# Altium schematic sheet [03] - NDP, LRA and BLE.SchDoc
size A3; DrawnBy: JW; DocumentNumber: 3; SheetNumber: 3; SheetTotal: 3
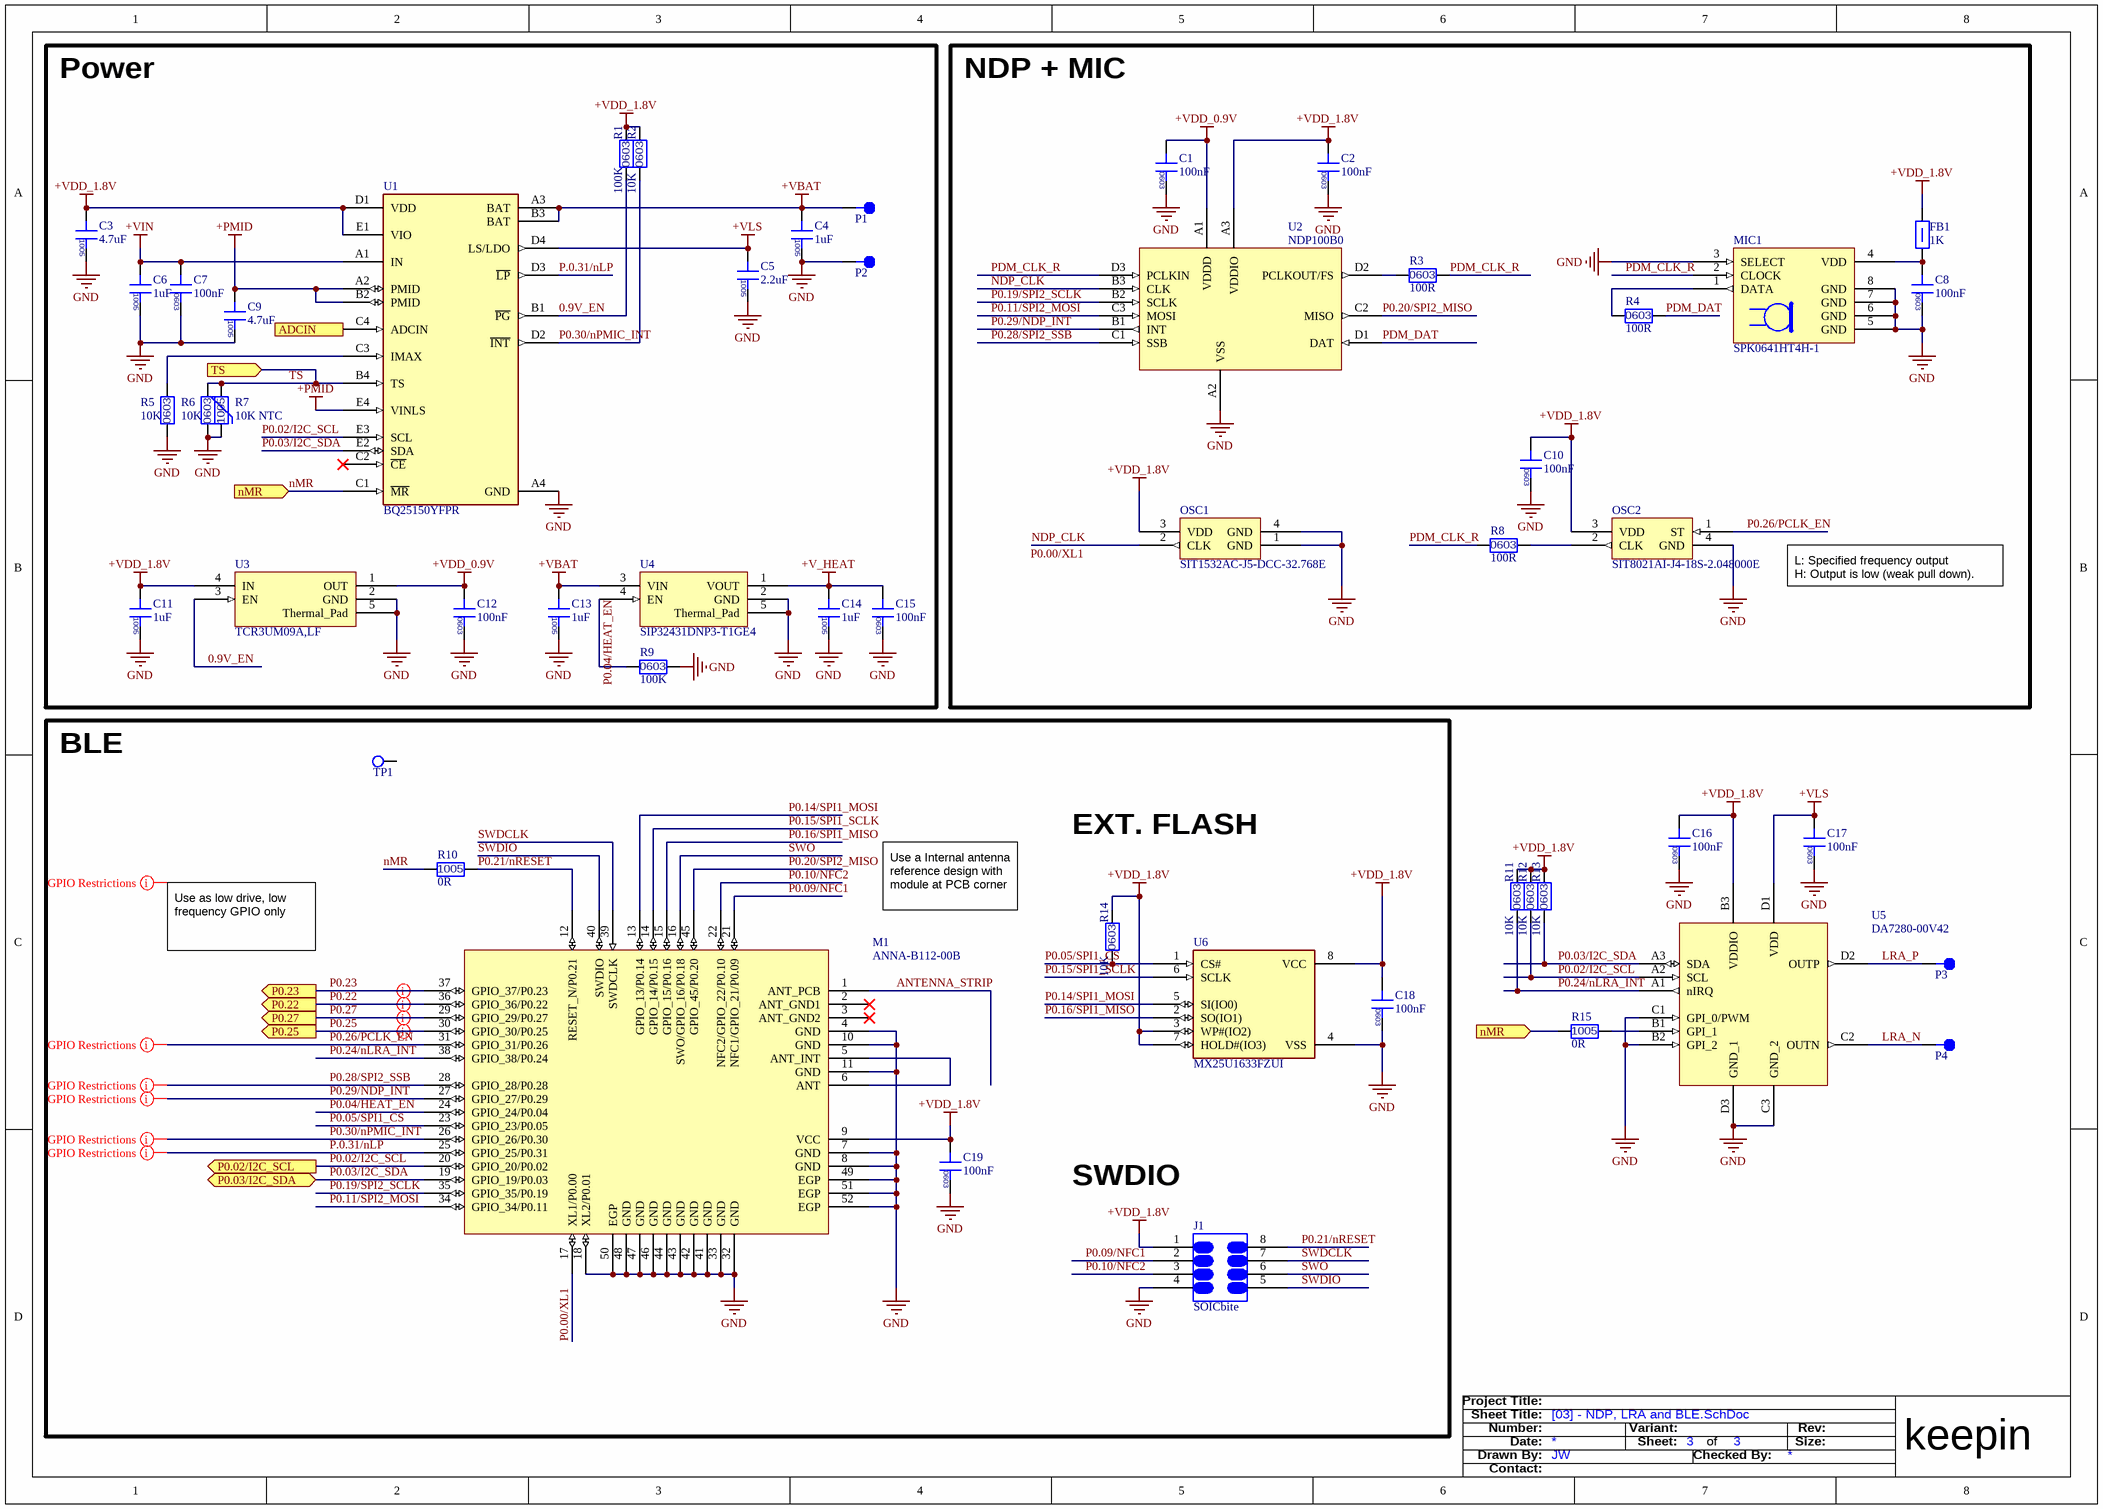
[diagram p0: [03] - NDP, LRA and BLE.SchDoc]

## Parts
C1  100nF  [CAPC0603X03N]
C2  100nF  [CAPC0603X03N]
C3  4.7uF  [CAPC1005X06N]
C4  1uF  [CAPC1005X06N]
C5  2.2uF  [CAPC1005X06N]
C6  1uF  [CAPC1005X06N]
C7  100nF  [CAPC0603X03N]
C8  100nF  [CAPC0603X03N]
C9  4.7uF  [CAPC1005X06N]
C10  100nF  [CAPC0603X03N]
C11  1uF  [CAPC1005X06N]
C12  100nF  [CAPC0603X03N]
C13  1uF  [CAPC1005X06N]
C14  1uF  [CAPC1005X06N]
C15  100nF  [CAPC0603X03N]
C16  100nF  [CAPC0603X03N]
C17  100nF  [CAPC0603X03N]
C18  100nF  [CAPC0603X03N]
C19  100nF  [CAPC0603X03N]
FB1  1K  [INDC1005X05N]
J1  SOICbite  [SOICBITE]  (no BOM)
M1  ANNA-B112-00B  [ANNA-B112]
MIC1  SPK0641HT4H-1  [MIC_SPK0838HT4H-1]
OSC1  SIT1532AC-J5-DCC-32.768E  [SIT1532]
OSC2  SIT8021AI-J4-18S-2.048000E  [SIT1532]
P1  1x1_Octagonal_1.27  [1x1_OCTAGONAL_1.27]  (value not drawn)  (no BOM)
P2  1x1_Octagonal_1.27  [1x1_OCTAGONAL_1.27]  (value not drawn)  (no BOM)
P3  1x1_Octagonal_1.27  [1x1_OCTAGONAL_1.27]  (value not drawn)  (no BOM)
P4  1x1_Octagonal_1.27  [1x1_OCTAGONAL_1.27]  (value not drawn)  (no BOM)
R1  100K  [RESC0603X02N]
R2  10K  [RESC0603X02N]
R3  100R  [RESC0603X02N]
R4  100R  [RESC0603X02N]
R5  10K  [RESC0603X02N]
R6  10K  [RESC0603X02N]
R7  10K NTC  [NTC1005X05N]
R8  100R  [RESC0603X02N]
R9  100K  [RESC0603X02N]
R10  0R  [RESC1005X04N]
R11  10K  [RESC0603X02N]
R12  10K  [RESC0603X02N]
R13  10K  [RESC0603X02N]
R14  10K  [RESC0603X02N]
R15  0R  [RESC1005X04N]
TP1  TESTPOINT  [TESTPOINT_1mm]  (value not drawn)  (no BOM)
U1  BQ25150YFPR  [YFP0020ACAC]
U2  NDP100B0  [NDP100B0_BGA12C40P3X4_139X176X55]
U3  TCR3UM09A,LF  [DQN-4]
U4  SIP32431DNP3-T1GE4  [SON50P160X60_HS-5N]
U5  DA7280-00V42  [BGA12C40P3X4_135X175X57]
U6  MX25U1633FZUI  [USON8_3X2]

## Blocks framed on the sheet
Power: C3-C7 C9 C11-C15 P1 P2 R1 R2 R5-R7 R9 U1 U3 U4
NDP + MIC: C1 C2 C8 C10 FB1 MIC1 OSC1 OSC2 R3 R4 R8 U2

## Ports
ADCIN (in), nMR (in), P0.02/I2C_SCL (out), P0.03/I2C_SDA (bidir), P0.22 (out), P0.23 (out), P0.25 (out), P0.27 (out), TS (in)

## Nets
+PMID: C9.2 U1.A2(PMID) U1.B2(PMID) U1.E4(VINLS)
+V_HEAT: C14.2 C15.2 U4.1(VOUT)
+VBAT: C4.2 C13.2 P1.1 U1.A3(BAT) U1.B3(BAT) U4.3(VIN)
+VDD_0.9V: C1.2 C12.2 U2.A1(VDDD) U3.1(OUT)
+VDD_1.8V: C2.2 C3.2 C10.2 C11.2 C16.2 C18.2 C19.2 FB1.1 J1.1 M1.9(VCC) OSC1.3(VDD) OSC2.3(VDD) R1.2 R2.2 R11.2 R12.2 R13.2 R14.2 U1.D1(VDD) U1.E1(VIO) U2.A3(VDDIO) U3.4(IN) U5.B3(VDDIO) U6.3(WP#(IO2)) U6.7(HOLD#(IO3)) U6.8(VCC)
+VIN: C6.2 C7.2 U1.A1(IN)
+VLS: C5.2 C17.2 U1.D4(LS/LDO) U5.D1(VDD)
GND: C1.1 C2.1 C3.1 C4.1 C5.1 C6.1 C7.1 C8.1 C9.1 C10.1 C11.1 C12.1 C13.1 C14.1 C15.1 C16.1 C17.1 C18.1 C19.1 J1.4 M1.4(GND) M1.7(GND) M1.8(GND) M1.10(GND) M1.11(GND) M1.18(XL2/P0.01) M1.32(GND) M1.33(GND) M1.41(GND) M1.42(GND) M1.43(GND) M1.44(GND) M1.46(GND) M1.47(GND) M1.48(GND) M1.49(EGP) M1.50(EGP) M1.51(EGP) M1.52(EGP) MIC1.3(SELECT) MIC1.5(GND) MIC1.6(GND) MIC1.7(GND) MIC1.8(GND) OSC1.1(GND) OSC1.4(GND) OSC2.4(GND) P2.1 R5.1 R6.1 R7.1 R9.2 U1.A4(GND) U2.A2(VSS) U3.2(GND) U3.5(Thermal_Pad) U4.2(GND) U4.5(Thermal_Pad) U5.B2(GPI_2) U5.C1(GPI_0/PWM) U5.C3(GND_2) U5.D3(GND_1) U6.4(VSS)
0.9V_EN: R1.1 U1.B1(~{PG}) U3.3(EN)
ADCIN: U1.C4(ADCIN) ; port ADCIN
ANTENNA_STRIP: M1.1(ANT_PCB)
LRA_N: P4.1 U5.C2(OUTN)
LRA_P: P3.1 U5.D2(OUTP)
NDP_CLK: M1.17(XL1/P0.00) OSC1.2(CLK) U2.B3(CLK)  [also labelled P0.00/XL1]
nMR: R10.1 R15.1 U1.C1(~{MR}) ; port nMR
P0.02/I2C_SCL: M1.20(GPIO_20/P0.02) R12.1 U1.E3(SCL) U5.A2(SCL) ; port P0.02/I2C_SCL
P0.03/I2C_SDA: M1.19(GPIO_19/P0.03) R13.1 U1.E2(SDA) U5.A3(SDA) ; port P0.03/I2C_SDA
P0.04/HEAT_EN: M1.24(GPIO_24/P0.04) R9.1 U4.4(EN)
P0.05/SPI1_CS: M1.23(GPIO_23/P0.05) R14.1 U6.1(CS#)
P0.09/NFC1: J1.2 M1.21(NFC1/GPIO_21/P0.09)
P0.10/NFC2: J1.3 M1.22(NFC2/GPIO_22/P0.10)
P0.11/SPI2_MOSI: M1.34(GPIO_34/P0.11) U2.C3(MOSI)
P0.14/SPI1_MOSI: M1.13(GPIO_13/P0.14) U6.5(SI(IO0))
P0.15/SPI1_SCLK: M1.14(GPIO_14/P0.15) U6.6(SCLK)
P0.16/SPI1_MISO: M1.15(GPIO_15/P0.16) U6.2(SO(IO1))
P0.19/SPI2_SCLK: M1.35(GPIO_35/P0.19) U2.B2(SCLK)
P0.20/SPI2_MISO: M1.45(GPIO_45/P0.20) U2.C2(MISO)
P0.21/nRESET: J1.8 M1.12(RESET_N/P0.21) R10.2
P0.22: M1.36(GPIO_36/P0.22) ; port P0.22
P0.23: M1.37(GPIO_37/P0.23) ; port P0.23
P0.24/nLRA_INT: M1.38(GPIO_38/P0.24) R11.1 U5.A1(nIRQ)
P0.25: M1.30(GPIO_30/P0.25) ; port P0.25
P0.26/PCLK_EN: M1.31(GPIO_31/P0.26) OSC2.1(ST)
P0.27: M1.29(GPIO_29/P0.27) ; port P0.27
P0.28/SPI2_SSB: M1.28(GPIO_28/P0.28) U2.C1(SSB)
P0.29/NDP_INT: M1.27(GPIO_27/P0.29) U2.B1(INT)
P0.30/nPMIC_INT: M1.26(GPIO_26/P0.30) R2.1 U1.D2(~{INT})
P.0.31/nLP: M1.25(GPIO_25/P0.31) U1.D3(~{LP})
PDM_CLK_R: MIC1.2(CLOCK) R3.2 R8.1 U2.D3(PCLKIN)
PDM_DAT: R4.2 U2.D1(DAT)
SWDCLK: J1.7 M1.39(SWDCLK)
SWDIO: J1.5 M1.40(SWDIO)
SWO: J1.6 M1.16(SWO/GPIO_16/P0.18)
TS: R6.2 R7.2 U1.B4(TS) ; port TS
NetC8_2: C8.2 FB1.2 MIC1.4(VDD)
NetM1_5: M1.5(ANT_INT) M1.6(ANT)
NetMIC1_1: MIC1.1(DATA) R4.1
NetOSC2_2: OSC2.2(CLK) R8.2
NetR3_1: R3.1 U2.D2(PCLKOUT/FS)
NetR5_2: R5.2 U1.C3(IMAX)
NetR15_2: R15.2 U5.B1(GPI_1)

Not connected (* = marked no-connect by the designer): M1 2(ANT_GND1)* 3(ANT_GND2)*; TP1 1; U1 C2(~{CE})*

## Layout directives
net class GPIO Restrictions: (no net found under the mark), P0.22, P0.23, P0.25, P0.26/PCLK_EN, P0.27, P0.28/SPI2_SSB, P0.29/NDP_INT, P0.30/nPMIC_INT, P.0.31/nLP

## Notes on the sheet
- L: Specified frequency output
  H: Output is low (weak pull down).
- BLE
- EXT. FLASH
- Use a Internal antenna reference design with module at PCB corner
- Use as low drive, low frequency GPIO only
- SWDIO
- Project Title:
- Number:
- Date:
- Sheet Title:
- Drawn By:
- Sheet:
- Variant:
- of
- Checked By:
- Rev:
- Size:
- keepin
- Contact:

## Library data of the parts
C1 C2 C7 C8 C10 C12 C15-C19 = GRM033C71C104ME14D: CAP CER 0.1UF 16V X7S 0201; Manufacturer: Murata; Tolerance: 20%; Supplier 1: Digi-Key; Supplier Part Number 1: 490-10388-1-ND; Manufacturer Part Number: GRM033C71C104ME14D; RoHS: Yes; Category: Ceramic Capacitors; Stock 1: 1023970; Pricing 1: 1=0.10000, 10=0.05100, 50=0.02780, 100=0.02260, 500=0.01616, 1000=0.01270, 2500=0.01155, 5000=0.01063 (USD); Mount: Surface Mount; Case/Package: 0201; Case Code (Metric): 0603; Case Code (Imperial): 0201; Weight: 1.2E-05oz; Min Operating Temperature: -55°C; Max Operating Temperature: 125°C; Capacitance: 100nF; Packaging: Tape and Reel; Voltage Rating: 16V; Dielectric: X7S; Termination: SMD/SMT; Voltage Rating (DC): 16V; Package Quantity: 15000; Length: 0.024inch; Width: 0.012inch; Height: 0.3mm; Thickness: 0.013inch; RoHS Compliant: Yes; ComponentLink1URL: http://www.mouser.com/ds/2/281/c02e-2905.pdf?src-supplier=Mouser; ComponentLink1Description: http://www.mouser.com/ds/2/281/c02e-2905.pdf?src-supplier=Mouser; ComponentLink2URL: http://search.murata.co.jp/Ceramy/image/img/A01X/G101/ENG/GRM033C71C104ME14-01.pdf?src-supplier=Digi-Key; ComponentLink2Description: http://search.murata.co.jp/Ceramy/image/img/A01X/G101/ENG/GRM033C71C104ME14-01.pdf?src-supplier=Digi-Key
C3 C9 = CL05A475MO5NUNC: CAP CER 4.7UF 16V X5R 0402; Manufacturer 1: Samsung; Tolerance: 20%; Category 1: Capacitors; Category 2: Ceramic Capacitors; Supplier 1: Digi-Key; Manufacturer Part Number 1: CL05A475MO5NUNC; Stock 1: 1960205; Pricing 1: 1=0.45000, 10=0.32100, 100=0.21130, 500=0.15656, 1000=0.13307, 2500=0.12524, 5000=0.11741 (USD); RoHS: Yes; Mount: Surface Mount; Case/Package: 0402; Case Code (Imperial): 0402; Case Code (Metric): 1005; Min Operating Temperature: -55°C; Max Operating Temperature: 85°C; Packaging: Tape and Reel; Capacitance: 4.7uF; Voltage Rating: 16V; Length: 0.039inch; Width: 0.02inch; Thickness: 0.022inch; ComponentLink1URL: http://www.farnell.com/datasheets/2710653.pdf?src-supplier=Farnell; ComponentLink1Description: http://www.farnell.com/datasheets/2710653.pdf?src-supplier=Farnell; ComponentLink2URL: http://www.samsungsem.com/kr/support/product-search/mlcc/CL05A475MO5NUNC.jsp?src-supplier=Digi-Key; ComponentLink2Description: http://www.samsungsem.com/kr/support/product-search/mlcc/CL05A475MO5NUNC.jsp?src-supplier=Digi-Key; ComponentLink3URL: http://www.farnell.com/datasheets/2710653.pdf?src-supplier=Newark; ComponentLink3Description: http://www.farnell.com/datasheets/2710653.pdf?src-supplier=Newark; Supplier Part Number 1: 1276-6836-1-ND; Manufacturer: Samsung; Manufacturer Part Number: CL05A475MO5NUNC
C4 C6 C11 C13 C14 = CL05A105KO5NNNC: CAP CER 1UF 16V X5R 0402; Manufacturer: Samsung; Tolerance: 10%; Supplier 1: Digi-Key; Supplier Part Number 1: 1276-1067-1-ND; Manufacturer Part Number: CL05A105KO5NNNC; RoHS: Yes; Category: Ceramic Capacitors; Stock 1: 2455652; Pricing 1: 1=0.10000, 10=0.04400, 50=0.02400, 100=0.01960, 500=0.01402, 1000=0.01101, 2500=0.01001, 5000=0.00921 (USD); Mount: Surface Mount; Case/Package: 0402; Contact Plating: Tin; Case Code (Imperial): 0402; Case Code (Metric): 1005; Min Operating Temperature: -55°C; Max Operating Temperature: 85°C; Capacitance: 1uF; Dielectric: X5R; Packaging: Tape and Reel; Package Quantity: 1; Voltage Rating: 16V; Voltage: 16V; Length: 1mm; Width: 0.02inch; Height: 0.5mm; Thickness: 0.022inch; Depth: 0.5mm; Radiation Hardening: No; ComponentLink1URL: https://datasheet.ciiva.com/16207/cl05a105ko5nnnc-16207571.pdf?src-supplier=Future+Electronics; ComponentLink1Description: https://datasheet.ciiva.com/16207/cl05a105ko5nnnc-16207571.pdf?src-supplier=Future+Electronics; ComponentLink2URL: https://datasheet.ciiva.com/15195/getdatasheetpartid-355272-15195629.pdf?src-supplier=Verical; ComponentLink2Description: https://datasheet.ciiva.com/15195/getdatasheetpartid-355272-15195629.pdf?src-supplier=Verical
C5 = CL05A225KP7NSB8: CAP CER 2.2UF 10V X5R 0402; Manufacturer: Samsung; Tolerance: 10%; Category 1: Capacitors; Category 2: Ceramic Capacitors; Supplier 1: Digi-Key; Manufacturer Part Number: CL05A225KP7NSB8; Stock 1: 159500; Pricing 1: 1=0.37000, 10=0.25500, 100=0.14450, 500=0.10198, 1000=0.08924, 2500=0.08499 (USD); RoHS: Yes; Mount: Surface Mount; Case/Package: 0402; Case Code (Imperial): 0402; Case Code (Metric): 1005; Min Operating Temperature: -55°C; Max Operating Temperature: 85°C; Packaging: Tape and Reel; Capacitance: 2.2uF; Voltage Rating: 10V; Length: 0.039inch; Width: 0.02inch; Thickness: 0.031inch; ComponentLink1URL: http://www.samsungsem.com/kr/support/product-search/mlcc/CL05A225KP7NSB8.jsp?src-supplier=Digi-Key; ComponentLink1Description: http://www.samsungsem.com/kr/support/product-search/mlcc/CL05A225KP7NSB8.jsp?src-supplier=Digi-Key; Supplier Part Number 1: 1276-6820-1-ND
FB1 = BLM15HG102SN1D: FERRITE BEAD 1 KOHM 0402 1LN; Manufacturer 1: Murata; Material: Steel,Ferrite; Impedance: 1kR; Tolerance: 25%; DC Resistance (DCR): 1.1R; Max DC Current: 250mA; Number of Lines: 1; Test Frequency: 100MHz; Shielding: Unshielded; Supplier 1: Digi-Key; Supplier Part Number 1: 490-3999-1-ND; Manufacturer Part Number 1: BLM15HG102SN1D; RoHS: Yes; Category: Ferrite Beads and Chips; Stock 1: 231333; Pricing 1: 1=0.19000, 10=0.14500, 25=0.12040, 50=0.10360, 100=0.09330, 250=0.07880, 500=0.07050, 1000=0.06013, 5000=0.05598 (USD); Case/Package: 0402; Number of Pins: 2; Core Material: Ferrite; Case Code (Metric): 1005; Case Code (Imperial): 0402; Contact Plating: Tin,Matte; Min Operating Temperature: -55°C; Max Operating Temperature: 125°C; Package Quantity: 1; Packaging: Tape and Reel; Current Rating: 250mA; Max Current Rating: 250mA; Termination: SMD/SMT; DC Current: 250mA; Military Standard: Not; Frequency: 100MHz; Number of Circuits: 1; Length: 1mm; Height: 0.5mm; Width: 0.5mm; Depth: 0.5mm; Radiation Hardening: No; REACH SVHC: No SVHC; Lead Free: Lead Free; ComponentLink1URL: https://datasheet.ciiva.com/18089/getdatasheetpartid-153017-18089624.pdf?src-supplier=Verical; ComponentLink1Description: https://datasheet.ciiva.com/18089/getdatasheetpartid-153017-18089624.pdf?src-supplier=Verical; ComponentLink2URL: https://datasheet.ciiva.com/11799/0900766b811b5866-11799183.pdf?src-supplier=RSComponents; ComponentLink2Description: https://datasheet.ciiva.com/11799/0900766b811b5866-11799183.pdf?src-supplier=RSComponents; ComponentLink3URL: https://datasheet.ciiva.com/29347/442241-da-01-en-chip-drossel-0402-1000r-250ma-1-0x0-5mm-29347884.pdf?src-supplier=Conrad; ComponentLink3Description: https://datasheet.ciiva.com/29347/442241-da-01-en-chip-drossel-0402-1000r-250ma-1-0x0-5mm-29347884.pdf?src-supplier=Conrad; ComponentLink4URL: https://datasheet.ciiva.com/41449/001172203-da-01-en-drossel-0402-1000r-21-0x0-5mm-10000st-41449490.pdf?src-supplier=Conrad; ComponentLink4Description: https://datasheet.ciiva.com/41449/001172203-da-01-en-drossel-0402-1000r-21-0x0-5mm-10000st-41449490.pdf?src-supplier=Conrad; ComponentLink5URL: https://datasheet.ciiva.com/3081/l0110s0101blm15h-3081607.pdf?src-supplier=Avnet; ComponentLink5Description: https://datasheet.ciiva.com/3081/l0110s0101blm15h-3081607.pdf?src-supplier=Avnet; ComponentLink6URL: https://datasheet.ciiva.com/17279/l0110s0101blm15h-17279639.pdf?src-supplier=Avnet+Europe; ComponentLink6Description: https://datasheet.ciiva.com/17279/l0110s0101blm15h-17279639.pdf?src-supplier=Avnet+Europe; ComponentLink7URL: https://datasheet.ciiva.com/1012/l0110s0101blm15h-1012788.pdf?src-supplier=Digi-Key; ComponentLink7Description: https://datasheet.ciiva.com/1012/l0110s0101blm15h-1012788.pdf?src-supplier=Digi-Key; ComponentLink8URL: https://datasheet.ciiva.com/1466/5168-1466916.pdf?src-supplier=Element14; ComponentLink8Description: https://datasheet.ciiva.com/1466/5168-1466916.pdf?src-supplier=Element14; ComponentLink9URL: https://datasheet.ciiva.com/1466/5168-1466915.pdf?src-supplier=Element14; ComponentLink9Description: https://datasheet.ciiva.com/1466/5168-1466915.pdf?src-supplier=Element14; ComponentLink10URL: https://datasheet.ciiva.com/1012/l0110s0101blm15h-1012789.pdf?src-supplier=Digi-Key; ComponentLink10Description: https://datasheet.ciiva.com/1012/l0110s0101blm15h-1012789.pdf?src-supplier=Digi-Key; ComponentLink11URL: https://datasheet.ciiva.com/1012/l0110s0101blm15h-1012790.pdf?src-supplier=Digi-Key; ComponentLink11Description: https://datasheet.ciiva.com/1012/l0110s0101blm15h-1012790.pdf?src-supplier=Digi-Key; Manufacturer: Murata; Manufacturer Part Number: BLM15HG102SN1D
J1 = SOICbite: A compact PCB footprint which allows SOIC test clips to be used as a space-efficient programming and debugging connector; Manufacturer: SimonMerrett; Manufacturer Part Number: SOICbite; Category: Connectors; Supplier 1: *; Supplier Unit Price 1: *; Supplier Currency 1: *; ComponentLink1Description: https://github.com/SimonMerrett/SOICbite; ComponentLink1URL: https://github.com/SimonMerrett/SOICbite
M1 = ANNA-B112-00B: RX TXRX MODULE BLUETOOTH SMD; Manufacturer: u-blox; Frequency: 2.4GHz; Interface: SPI,USB,UART; Sensitivity: -96dBm; Data Rate: 2Mbps; Supplier 1: Digi-Key; Supplier Part Number 1: 672-1101-1-ND; Manufacturer Part Number: ANNA-B112-00B; RoHS: No; Category: RF Receivers, Transceivers; Stock 1: 24; Pricing 1: 1=8.90000, 10=7.56700, 50=6.43180, 100=5.79880 (USD); Case/Package: SMD/SMT; Min Operating Temperature: -40°C; Max Operating Temperature: 85°C; Packaging: Tape and Reel; ComponentLink1URL: https://www.u-blox.com/sites/default/files/ANNA-B112_DataSheet_%28UBX-18011707%29.pdf?src-supplier=Digi-Key; ComponentLink1Description: https://www.u-blox.com/sites/default/files/ANNA-B112_DataSheet_%28UBX-18011707%29.pdf?src-supplier=Digi-Key
MIC1 = SPK0641HT4H-1: RAMIS MIC MULTIMODE DGT TOP PORT; Manufacturer: Knowles; Shape: Rectangular; Output Type: Digital; Direction: Omnidirectional; Operating Supply Current: 800uA; Supplier 1: Digi-Key; Supplier Part Number 1: 423-1425-1-ND; Manufacturer Part Number: SPK0641HT4H-1; RoHS: No; Category: Microphones; Stock 1: 23510; Pricing 1: 1=1.33000, 10=1.11100, 25=1.02840, 50=0.96800, 100=0.90970, 500=0.78270, 1000=0.73167 (USD); Packaging: Cut Tape; Termination: Solder; ComponentLink1URL: https://www.knowles.com/docs/default-source/model-downloads/spk0641ht4h-1-rev-a.pdf?src-supplier=Digi-Key; ComponentLink1Description: https://www.knowles.com/docs/default-source/model-downloads/spk0641ht4h-1-rev-a.pdf?src-supplier=Digi-Key
OSC1 = SIT1532AC-J5-DCC-32.768E: MEMS OSC XO 32.7680KHZ LVCMOS; Manufacturer: SiTime; Frequency: 32.768kHz; Frequency Stability: 75ppm; Max Supply Current: 1.3uA; Supplier 1: Digi-Key; Supplier Part Number 1: 1473-1313-1-ND; Manufacturer Part Number: SIT1532AC-J5-DCC-32.768E; RoHS: Yes; Category: Oscillators; Stock 1: 4488; Pricing 1: 1=1.25000, 10=1.10300, 50=1.03120, 100=0.91120, 500=0.86328 (USD); Mount: Surface Mount; Min Operating Temperature: -10°C; Max Operating Temperature: 70°C; Packaging: Tape and Reel; Length: 0.061inch; Height: 0.024inch; Width: 0.033inch; ComponentLink1URL: http://www.sitime.com/products/datasheets/sit1532/SiT1532-datasheet.pdf?src-supplier=Digi-Key; ComponentLink1Description: http://www.sitime.com/products/datasheets/sit1532/SiT1532-datasheet.pdf?src-supplier=Digi-Key; ComponentLink2URL: https://www.sitime.com/datasheet/SiT1532?src-supplier=Digi-Key; ComponentLink2Description: https://www.sitime.com/datasheet/SiT1532?src-supplier=Digi-Key
OSC2 = SIT8021AI-J4-18S-2.048000E: MEMS OSC XO 2.0480MHZ LVCMOS SMD; Manufacturer: SiTime; Frequency: 2.048MHz; Max Supply Current: 130uA; Frequency Stability: 100ppm; Supplier 1: Digi-Key; Supplier Part Number 1: 1473-1352-1-ND; Manufacturer Part Number: SIT8021AI-J4-18S-2.048000E; RoHS: Yes; Category: Oscillators; Stock 1: 1642; Pricing 1: 1=1.21000, 10=1.07200, 50=1.00200, 100=0.97860 (USD); Mount: Surface Mount; Min Operating Temperature: -40°C; Max Operating Temperature: 85°C; Packaging: Tape and Reel; Length: 0.061inch; Width: 0.033inch; Height: 0.024inch; RoHS Compliant: Yes; ComponentLink1URL: http://www.sitime.com/products/datasheets/sit8021/SiT8021-datasheet.pdf?src-supplier=Digi-Key; ComponentLink1Description: http://www.sitime.com/products/datasheets/sit8021/SiT8021-datasheet.pdf?src-supplier=Digi-Key; ComponentLink2URL: https://www.sitime.com/datasheet/SiT8021?src-supplier=Digi-Key; ComponentLink2Description: https://www.sitime.com/datasheet/SiT8021?src-supplier=Digi-Key
R1 R9 = RC0201JR-07100KL: RES SMD 100K OHM 5% 1/20W 0201; Manufacturer: Yageo; Resistance: 100kR; Temperature Coefficient: 200ppm/°C; Power Rating: 50mW; Voltage Rating: 25V; Supplier 1: Digi-Key; Supplier Part Number 1: 311-100KNCT-ND; Manufacturer Part Number: RC0201JR-07100KL; RoHS: Yes; Category: Chip SMD Resistors; Stock 1: 18115; Pricing 1: 1=0.10000, 10=0.02900, 100=0.01190, 1000=0.00536, 2500=0.00466, 5000=0.00385 (USD); Case/Package: 0201; Contact Plating: Tin,Matte; Case Code (Metric): 0603; Case Code (Imperial): 0201; Weight: 6E-06oz; Size Code: 0201; Min Operating Temperature: -55°C; Max Operating Temperature: 125°C; Tolerance: 5%; Resistor Type: Thick Film; Package Quantity: 1; Packaging: Tape and Reel; Number of Terminations: 2; Termination: SMD/SMT; Max Power Dissipation: 50mW; Voltage Rating (DC): 25V; Features: Moisture Resistant; Series: RC; Resistance Tolerance: 5%; Construction: Rectangular; Length: 0.6mm; Width: 0.012inch; Height: 0.01inch; Depth: 0.3mm; Radiation Hardening: No; REACH SVHC: No SVHC; Military Standard: Not; Lead Free: Lead Free; RoHS Compliant: Yes; ComponentLink1URL: https://datasheet.ciiva.com/2462/pyu-r-int-thick-7-2462817.pdf?src-supplier=Digi-Key; ComponentLink1Description: https://datasheet.ciiva.com/2462/pyu-r-int-thick-7-2462817.pdf?src-supplier=Digi-Key; ComponentLink2URL: https://datasheet.ciiva.com/2462/pyu-r-int-thick-7-2462818.pdf?src-supplier=Digi-Key; ComponentLink2Description: https://datasheet.ciiva.com/2462/pyu-r-int-thick-7-2462818.pdf?src-supplier=Digi-Key; ComponentLink3URL: https://datasheet.ciiva.com/2462/pyu-r-int-thick-7-2462819.pdf?src-supplier=Digi-Key; ComponentLink3Description: https://datasheet.ciiva.com/2462/pyu-r-int-thick-7-2462819.pdf?src-supplier=Digi-Key; ComponentLink4URL: https://datasheet.ciiva.com/28639/1421516-28639863.pdf?src-supplier=Element14; ComponentLink4Description: https://datasheet.ciiva.com/28639/1421516-28639863.pdf?src-supplier=Element14; ComponentLink5URL: https://datasheet.ciiva.com/8888/pyu-rc0201-51-rohs-l-8-8888005.pdf?src-supplier=Avnet; ComponentLink5Description: https://datasheet.ciiva.com/8888/pyu-rc0201-51-rohs-l-8-8888005.pdf?src-supplier=Avnet; ComponentLink6URL: https://datasheet.ciiva.com/8896/pyu-rc0201-51-rohs-l-8-8896213.pdf?src-supplier=Avnet; ComponentLink6Description: https://datasheet.ciiva.com/8896/pyu-rc0201-51-rohs-l-8-8896213.pdf?src-supplier=Avnet; ComponentLink7URL: https://datasheet.ciiva.com/7672/1563626-7672249.pdf?src-supplier=Element14; ComponentLink7Description: https://datasheet.ciiva.com/7672/1563626-7672249.pdf?src-supplier=Element14; ComponentLink8URL: https://datasheet.ciiva.com/7672/1563626-7672250.pdf?src-supplier=Element14; ComponentLink8Description: https://datasheet.ciiva.com/7672/1563626-7672250.pdf?src-supplier=Element14; ComponentLink9URL: https://datasheet.ciiva.com/28395/pyu-rc0201-51-rohs-l-8-28395542.pdf?src-supplier=Avnet+Europe; ComponentLink9Description: https://datasheet.ciiva.com/28395/pyu-rc0201-51-rohs-l-8-28395542.pdf?src-supplier=Avnet+Europe
R2 R5 R6 R11-R14 = RC0201FR-0710KL: RES SMD 10K OHM 1% 1/20W 0201; Manufacturer: Yageo; Temperature Coefficient: 200ppm/°C; Resistance: 10kR; Max Power Dissipation: 50mW; Working Voltage: 25V; Supplier 1: Digi-Key; Supplier Part Number 1: 311-10.0KMCT-ND; Manufacturer Part Number: RC0201FR-0710KL; RoHS: Yes; Category: Chip SMD Resistors; Stock 1: 7662035; Pricing 1: 1=0.10000, 10=0.03700, 100=0.01500, 1000=0.00673, 2500=0.00584, 5000=0.00483 (USD); Case/Package: 0201; Number of Pins: 2; Contact Plating: Tin,Matte; Weight: 6E-06oz; Case Code (Imperial): 0201; Case Code (Metric): 0603; Min Operating Temperature: -55°C; Max Operating Temperature: 125°C; Resistor Type: Thick Film; Tolerance: 1%; Features: Moisture Resistant; Termination: SMD/SMT; Number of Terminations: 2; Power Rating: 50mW; Voltage Rating: 25V; Packaging: Tape and Reel; Package Quantity: 1; Voltage Rating (DC): 25V; Length: 0.6mm; Width: 0.3mm; Height: 0.01inch; Depth: 0.3mm; Radiation Hardening: No; REACH SVHC: No SVHC; Military Standard: Not; Lead Free: Lead Free; ComponentLink1URL: https://datasheet.ciiva.com/2467/pyu-r-int-thick-7-2467109.pdf?src-supplier=Digi-Key; ComponentLink1Description: https://datasheet.ciiva.com/2467/pyu-r-int-thick-7-2467109.pdf?src-supplier=Digi-Key; ComponentLink2URL: https://datasheet.ciiva.com/2467/pyu-r-int-thick-7-2467110.pdf?src-supplier=Digi-Key; ComponentLink2Description: https://datasheet.ciiva.com/2467/pyu-r-int-thick-7-2467110.pdf?src-supplier=Digi-Key; ComponentLink3URL: https://datasheet.ciiva.com/2467/pyu-r-int-thick-7-2467111.pdf?src-supplier=Digi-Key; ComponentLink3Description: https://datasheet.ciiva.com/2467/pyu-r-int-thick-7-2467111.pdf?src-supplier=Digi-Key; ComponentLink4URL: https://datasheet.ciiva.com/7660/1421516-7660807.pdf?src-supplier=Element14; ComponentLink4Description: https://datasheet.ciiva.com/7660/1421516-7660807.pdf?src-supplier=Element14; ComponentLink5URL: https://datasheet.ciiva.com/8891/pyu-rc0201-51-rohs-l-8-8891384.pdf?src-supplier=Avnet; ComponentLink5Description: https://datasheet.ciiva.com/8891/pyu-rc0201-51-rohs-l-8-8891384.pdf?src-supplier=Avnet; ComponentLink6URL: https://datasheet.ciiva.com/28405/pyu-rc0201-51-rohs-l-8-28405609.pdf?src-supplier=Avnet+Europe; ComponentLink6Description: https://datasheet.ciiva.com/28405/pyu-rc0201-51-rohs-l-8-28405609.pdf?src-supplier=Avnet+Europe; ComponentLink7URL: https://datasheet.ciiva.com/26829/getdatasheetpartid-421074-26829851.pdf?src-supplier=Verical; ComponentLink7Description: https://datasheet.ciiva.com/26829/getdatasheetpartid-421074-26829851.pdf?src-supplier=Verical; ComponentLink8URL: https://datasheet.ciiva.com/46391/1421516-46391339.pdf?src-supplier=Element14; ComponentLink8Description: https://datasheet.ciiva.com/46391/1421516-46391339.pdf?src-supplier=Element14; ComponentLink9URL: https://datasheet.ciiva.com/16855/pyu-rc0201-51-rohs-l-8-16855789.pdf?src-supplier=Avnet+Europe; ComponentLink9Description: https://datasheet.ciiva.com/16855/pyu-rc0201-51-rohs-l-8-16855789.pdf?src-supplier=Avnet+Europe
R3 R4 R8 = RC0201FR-07100RL: RES SMD 100 OHM 1% 1/20W 0201; Manufacturer: Yageo; Temperature Coefficient: 200ppm/°C; Power Rating: 50mW; Voltage Rating: 25V; Supplier 1: Digi-Key; Supplier Part Number 1: 311-100MCT-ND; Manufacturer Part Number: RC0201FR-07100RL; RoHS: Yes; Category: Chip SMD Resistors; Stock 1: 263416; Pricing 1: 1=0.10000, 10=0.03700, 100=0.01500, 1000=0.00673, 2500=0.00584, 5000=0.00483 (USD); Case/Package: 0201; Contact Plating: Tin,Matte; Case Code (Metric): 0603; Case Code (Imperial): 0201; Min Operating Temperature: -55°C; Max Operating Temperature: 125°C; Resistance: 100R; Tolerance: 1%; Resistor Type: Thick Film; Packaging: Tape and Reel; Package Quantity: 1; Max Power Dissipation: 50mW; Number of Terminations: 2; Termination: SMD/SMT; Features: Moisture Resistant; Length: 0.024inch; Width: 0.012inch; Height: 0.01inch; Radiation Hardening: No; REACH SVHC: Unknown; Lead Free: Lead Free; ComponentLink1URL: https://datasheet.ciiva.com/2560/pyu-r-int-thick-7-2560865.pdf?src-supplier=Digi-Key; ComponentLink1Description: https://datasheet.ciiva.com/2560/pyu-r-int-thick-7-2560865.pdf?src-supplier=Digi-Key; ComponentLink2URL: https://datasheet.ciiva.com/2560/pyu-r-int-thick-7-2560866.pdf?src-supplier=Digi-Key; ComponentLink2Description: https://datasheet.ciiva.com/2560/pyu-r-int-thick-7-2560866.pdf?src-supplier=Digi-Key; ComponentLink3URL: https://datasheet.ciiva.com/2560/pyu-r-int-thick-7-2560867.pdf?src-supplier=Digi-Key; ComponentLink3Description: https://datasheet.ciiva.com/2560/pyu-r-int-thick-7-2560867.pdf?src-supplier=Digi-Key; ComponentLink4URL: https://datasheet.ciiva.com/16855/pyu-rc0201-51-rohs-l-8-16855781.pdf?src-supplier=Avnet+Europe; ComponentLink4Description: https://datasheet.ciiva.com/16855/pyu-rc0201-51-rohs-l-8-16855781.pdf?src-supplier=Avnet+Europe; ComponentLink5URL: https://datasheet.ciiva.com/8887/pyu-rc0201-51-rohs-l-8-8887865.pdf?src-supplier=Avnet; ComponentLink5Description: https://datasheet.ciiva.com/8887/pyu-rc0201-51-rohs-l-8-8887865.pdf?src-supplier=Avnet; ComponentLink6URL: https://datasheet.ciiva.com/28395/pyu-rc0201-51-rohs-l-8-28395391.pdf?src-supplier=Avnet+Europe; ComponentLink6Description: https://datasheet.ciiva.com/28395/pyu-rc0201-51-rohs-l-8-28395391.pdf?src-supplier=Avnet+Europe
R7 = NCP15XH103J03RC: THERMISTOR NTC 10KOHM 3380K 0402; Manufacturer 1: Murata; Resistance: 10kR; Tolerance: 5%; Power Rating: 100mW; Current Rating: 310uA; Accuracy: 0.7%; Category 1: Sensors, Transducers; Category 2: Temperature Sensors - NTC Thermistors; Supplier 1: Digi-Key; Supplier Part Number 1: 490-2414-1-ND; Manufacturer Part Number 1: NCP15XH103J03RC; RoHS: Yes; Category: Thermistors; Stock 1: 295142; Pricing 1: 1=0.12000, 5=0.11600, 10=0.10300, 25=0.09520, 50=0.07600, 100=0.06520, 500=0.05706, 1000=0.04891, 5000=0.04347 (USD); Mount: Surface Mount; Case/Package: 0402; Number of Pins: 2; Case Code (Metric): 1005; Case Code (Imperial): 0402; Min Operating Temperature: -40°C; Max Operating Temperature: 125°C; Package Quantity: 1; Packaging: Tape and Reel; Max Power Dissipation: 100mW; Termination: SMD/SMT; Length: 1mm; Height: 0.5mm; Width: 0.5mm; Depth: 0.5mm; Radiation Hardening: No; REACH SVHC: No SVHC; Lead Free: Lead Free; ComponentLink1URL: https://datasheet.ciiva.com/22712/1825737-22712084.pdf?src-supplier=Element14; ComponentLink1Description: https://datasheet.ciiva.com/22712/1825737-22712084.pdf?src-supplier=Element14; ComponentLink2URL: https://datasheet.ciiva.com/11822/0900766b807f1e39-11822074.pdf?src-supplier=RSComponents; ComponentLink2Description: https://datasheet.ciiva.com/11822/0900766b807f1e39-11822074.pdf?src-supplier=RSComponents; ComponentLink3URL: https://datasheet.ciiva.com/29387/506183-da-01-en-thermistor-murata-ncp15xh103j03rc-29387260.pdf?src-supplier=Conrad; ComponentLink3Description: https://datasheet.ciiva.com/29387/506183-da-01-en-thermistor-murata-ncp15xh103j03rc-29387260.pdf?src-supplier=Conrad; ComponentLink4URL: https://datasheet.ciiva.com/2848/r44e-2848211.pdf?src-supplier=Digi-Key; ComponentLink4Description: https://datasheet.ciiva.com/2848/r44e-2848211.pdf?src-supplier=Digi-Key; ComponentLink5URL: https://datasheet.ciiva.com/2848/r44e-2848212.pdf?src-supplier=Digi-Key; ComponentLink5Description: https://datasheet.ciiva.com/2848/r44e-2848212.pdf?src-supplier=Digi-Key; ComponentLink6URL: https://datasheet.ciiva.com/2848/r44e-2848213.pdf?src-supplier=Digi-Key; ComponentLink6Description: https://datasheet.ciiva.com/2848/r44e-2848213.pdf?src-supplier=Digi-Key; ComponentLink7URL: https://datasheet.ciiva.com/3282/l0770e-3282046.pdf?src-supplier=Avnet; ComponentLink7Description: https://datasheet.ciiva.com/3282/l0770e-3282046.pdf?src-supplier=Avnet; Manufacturer: Murata; Manufacturer Part Number: NCP15XH103J03RC
R10 R15 = RC0402JR-070RL: RES SMD 0 OHM JUMPER 1/16W 0402; Manufacturer: Yageo; Resistance: 0mR; Power Rating: 62.5mW; Tolerance: 5%; Voltage Rating: 50V; Temperature Coefficient: 200ppm/°C; Max Power Dissipation: 63mW; Category 1: Resistors; Category 2: Chip Resistor - Surface Mount; Supplier 1: Digi-Key; Manufacturer Part Number: RC0402JR-070RL; Stock 1: 68260221; Pricing 1: 1=0.10000, 10=0.01300, 25=0.00920, 50=0.00700, 100=0.00510, 250=0.00392, 500=0.00312, 1000=0.00230, 5000=0.00165 (USD); RoHS: Yes; Case/Package: 0402; Contact Plating: Tin,Matte; Case Code (Metric): 1005; Case Code (Imperial): 0402; Min Operating Temperature: -55°C; Max Operating Temperature: 155°C; Composition: Thick Film; Packaging: Tape and Reel; Termination: SMD/SMT; Package Quantity: 1; Number of Terminations: 2; Military Standard: Not; Features: Moisture Resistant; Length: 1mm; Height: 0.016inch; Width: 0.02inch; Depth: 0.5mm; Radiation Hardening: No; Lead Free: Lead Free; REACH SVHC: Unknown; ComponentLink1URL: https://datasheet.ciiva.com/2452/pyu-rc0402-51-rohs-l-6-2452608.pdf?src-supplier=Digi-Key; ComponentLink1Description: https://datasheet.ciiva.com/2452/pyu-rc0402-51-rohs-l-6-2452608.pdf?src-supplier=Digi-Key; ComponentLink2URL: https://datasheet.ciiva.com/11808/0900766b80c66297-11808195.pdf?src-supplier=RSComponents; ComponentLink2Description: https://datasheet.ciiva.com/11808/0900766b80c66297-11808195.pdf?src-supplier=RSComponents; ComponentLink3URL: https://datasheet.ciiva.com/2452/pyu-r-int-thick-7-2452609.pdf?src-supplier=Digi-Key; ComponentLink3Description: https://datasheet.ciiva.com/2452/pyu-r-int-thick-7-2452609.pdf?src-supplier=Digi-Key; ComponentLink4URL: https://datasheet.ciiva.com/2452/pyu-r-int-thick-7-2452610.pdf?src-supplier=Digi-Key; ComponentLink4Description: https://datasheet.ciiva.com/2452/pyu-r-int-thick-7-2452610.pdf?src-supplier=Digi-Key; ComponentLink5URL: https://datasheet.ciiva.com/8896/pyu-rc0402-51-rohs-l-6-8896201.pdf?src-supplier=Avnet; ComponentLink5Description: https://datasheet.ciiva.com/8896/pyu-rc0402-51-rohs-l-6-8896201.pdf?src-supplier=Avnet; ComponentLink6URL: https://datasheet.ciiva.com/28386/pyu-rc0402-51-rohs-l-6-28386633.pdf?src-supplier=Avnet+Europe; ComponentLink6Description: https://datasheet.ciiva.com/28386/pyu-rc0402-51-rohs-l-6-28386633.pdf?src-supplier=Avnet+Europe; ComponentLink7URL: https://datasheet.ciiva.com/22747/1018594-22747515.pdf?src-supplier=Element14; ComponentLink7Description: https://datasheet.ciiva.com/22747/1018594-22747515.pdf?src-supplier=Element14; ComponentLink8URL: https://datasheet.ciiva.com/15189/getdatasheetpartid-326379-15189533.pdf?src-supplier=Verical; ComponentLink8Description: https://datasheet.ciiva.com/15189/getdatasheetpartid-326379-15189533.pdf?src-supplier=Verical; ComponentLink9URL: https://datasheet.ciiva.com/7983/1018594-7983535.pdf?src-supplier=Element14; ComponentLink9Description: https://datasheet.ciiva.com/7983/1018594-7983535.pdf?src-supplier=Element14; Supplier Part Number 1: 311-0.0JRCT-ND; Mount: Surface Mount
TP1 = TESTPOINT: TESTPOINT PAD; Order number: no component; Component class: TP; Producer: n/a; Assembly type: no component; ClassName: TESTPOINTS
U1 = BQ25150YFPR: LOW IQ LINEAR BATTERY CHARGE MAN; Manufacturer: Texas Instruments; Supplier 1: Digi-Key; Supplier Part Number 1: 296-BQ25150YFPRCT-ND; Manufacturer Part Number: BQ25150YFPR; RoHS: No; Category: PMIC - Battery Chargers; Stock 1: 1459; Pricing 1: 1=2.80000, 10=2.51300, 25=2.37600, 100=1.95360, 250=1.75296, 500=1.68960, 1000=1.40448 (USD); Supplier 2: Digi-Key; Supplier Part Number 2: 296-53418-1-ND; Stock 2: 340; Pricing 2: 1=3.22000, 10=2.88900, 25=2.73160, 100=2.24590 (USD)
U2 = NDP100B0: IC NDP 32BIT 112KB SRAM WLBGA; Manufacturer: SYNTIANT; Manufacturer Part Number: NDP100B0; Case/Package: WLBGA; Mount: Surface Mount; Category: Neural Decision Processor
U3 = TCR3UM09A,LF: IC REG LINEAR 0.9V 300MA 4DFN; Manufacturer: Toshiba; Supplier 1: Digi-Key; Supplier Part Number 1: TCR3UM09ALFCT-ND; Manufacturer Part Number: TCR3UM09A,LF; RoHS: No; Stock 1: 32360; Pricing 1: 1=0.47000, 10=0.35600, 25=0.32080, 100=0.22150, 250=0.18656, 500=0.15158, 1000=0.11660, 2500=0.10494, 5000=0.09911 (USD)
U4 = SIP32431DNP3-T1GE4: IC PWR SWITCH P-CHAN 1:1 4TDFN; Manufacturer: Vishay Siliconix; Output Current: 1A; Number of Outputs: 1; Max Power Dissipation: 324mW; Max Supply Voltage: 5.5V; Min Supply Voltage: 1.1V; Interface: On/Off; Max Output Current: 1.4A; On-State Resistance: 520mR; Turn-Off Delay Time: 10us; Turn-On Delay Time: 40us; Fault Protection: Reverse Current; Output Configuration: High Side; Supplier 1: Digi-Key; Supplier Part Number 1: SIP32431DNP3-T1GE4CT-ND; Manufacturer Part Number: SIP32431DNP3-T1GE4; RoHS: Yes; Category: Hot Swap Controllers; Stock 1: 269438; Pricing 1: 1=0.60000, 10=0.52500, 25=0.49280, 100=0.40230, 250=0.37364, 500=0.31800, 1000=0.25440 (USD); Mount: Surface Mount; Number of Pins: 4; Weight: 0.001764oz; Min Operating Temperature: -40°C; Max Operating Temperature: 85°C; Packaging: Tape and Reel; Package Quantity: 3000; Power Dissipation: 324mW; Series: SIP324x1; Radiation Hardening: No; Lead Free: Lead Free; RoHS Compliant: Yes; ComponentLink1URL: https://datasheet.ciiva.com/15109/getdatasheetpartid-704627-15109219.pdf?src-supplier=Verical; ComponentLink1Description: https://datasheet.ciiva.com/15109/getdatasheetpartid-704627-15109219.pdf?src-supplier=Verical; ComponentLink2URL: https://datasheet.ciiva.com/1954/sip32431-1954885.pdf?src-supplier=Digi-Key; ComponentLink2Description: https://datasheet.ciiva.com/1954/sip32431-1954885.pdf?src-supplier=Digi-Key
U5 = DA7280-00V42: LRA/ERM HAPTIC DRIVER WLCSP12; Manufacturer: Dialog Semiconductor; Supplier 1: Digi-Key; Supplier Part Number 1: 1564-DA7280-00V42CT-ND; Manufacturer Part Number: DA7280-00V42; RoHS: No; Stock 1: 3330; Pricing 1: 1=2.36000, 10=2.12000, 25=2.00000, 100=1.70400, 250=1.60000, 500=1.40000, 1000=1.16000 (USD); RoHS Compliant: No
U6 = MX25U1633FZUI: IC FLASH 16MBIT SPI/QUAD 8USON; Manufacturer: Macronix; Supplier 1: Digi-Key; Supplier Part Number 1: 1092-MX25U1633FZUICT-ND; Manufacturer Part Number: MX25U1633FZUI; RoHS: Yes; Category: Memory; Stock 1: 14057; Pricing 1: 1=0.80000, 10=0.72800, 25=0.71840, 50=0.71420, 100=0.63860, 250=0.63324, 500=0.62388, 1000=0.60156, 5000=0.54792 (USD); RoHS Compliant: Yes
P1-P4 = 1x1_Octagonal_1.27: Manufacturer: *; Manufacturer Part Number: *; Category: *; Supplier 1: *; Supplier Unit Price 1: *; Supplier Currency 1: *